# Altium schematic sheet BM71BreakoutSchematic.SchDoc
size A
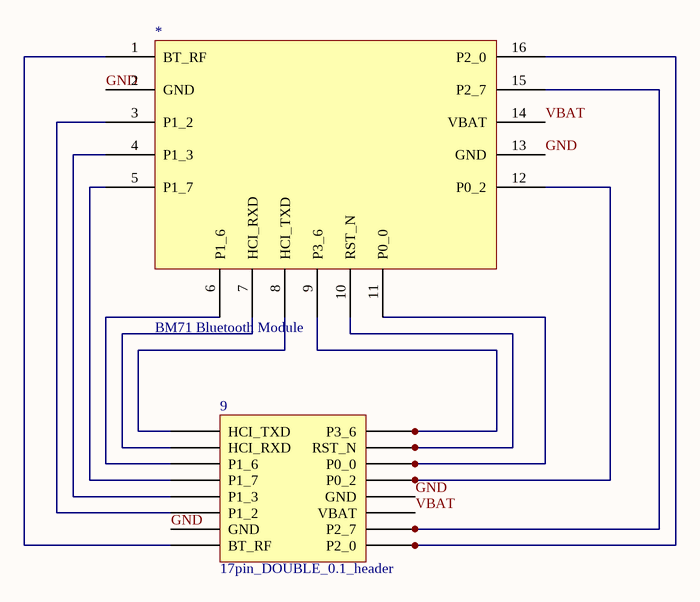
[diagram p0: BM71BreakoutSchematic.SchDoc]

## Parts
9  17pin_DOUBLE_0.1_header  [17pin_DOUBLE_0.1_header]
*  BM71 Bluetooth Module  [BM71BLES1FC2]

## Nets
GND: 9.2(GND) 9.13(GND) *.2(GND) *.13(GND)
VBAT: 9.14(VBAT) *.14(VBAT)
Net9_1: 9.1(BT_RF) *.1(BT_RF)
Net9_3: 9.3(P1_2) *.3(P1_2)
Net9_4: 9.4(P1_3) *.4(P1_3)
Net9_5: 9.5(P1_7) *.5(P1_7)
Net9_6: 9.6(P1_6) *.6(P1_6)
Net9_7: 9.7(HCI_RXD) *.7(HCI_RXD)
Net9_8: 9.8(HCI_TXD) *.8(HCI_TXD)
Net9_9: 9.9(P3_6) *.9(P3_6)
Net9_10: 9.10(RST_N) *.10(RST_N)
Net9_11: 9.11(P0_0) *.11(P0_0)
Net9_12: 9.12(P0_2) *.12(P0_2)
Net9_15: 9.15(P2_7) *.15(P2_7)
Net9_16: 9.16(P2_0) *.16(P2_0)